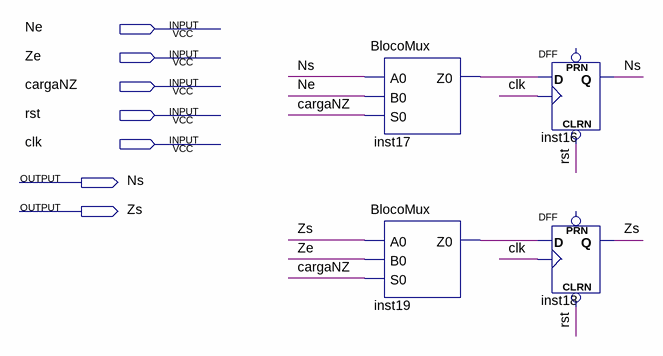
[diagram p0: schematic sheet]
// Quartus schematic NZ.bdf as structural Verilog: 4 symbols, 7 pins
module NZ (
  input  Ne,
  input  Ze,
  input  cargaNZ,
  input  rst,
  input  clk,
  output Ns,
  output Zs
);

  wire inst17_z0, inst19_z0;

  BlocoMux inst17 (.A0(Ns), .B0(Ne), .S0(cargaNZ), .Z0(inst17_z0));
  BlocoMux inst19 (.A0(Zs), .B0(Ze), .S0(cargaNZ), .Z0(inst19_z0));
  DFF inst16 (.CLRN(rst), .CLK(clk), .D(inst17_z0), .Q(Ns));  // open: PRN
  DFF inst18 (.CLRN(rst), .CLK(clk), .D(inst19_z0), .Q(Zs));  // open: PRN
endmodule
